# EAGLE design FC (EAGLE 9.6.2)
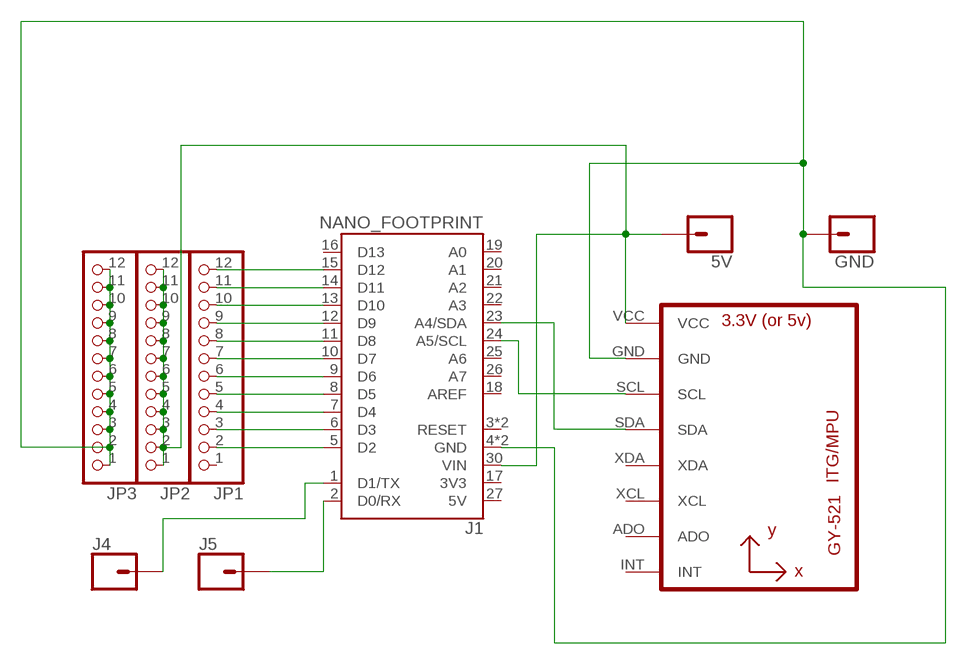
[diagram p0: schematic, sheet 1]

## Parts
5V  CONN_01PTH_NO_SILK_SMALL  [1X01_SMALL]
GND  CONN_01PTH_NO_SILK_SMALL  [1X01_SMALL]
J1  NANO_FOOTPRINT  [NANO]
J4  CONN_01  [1X01]
J5  CONN_01  [1X01]
JP1  PINHD-1X12-CB  [1X12-CB]
JP2  PINHD-1X12-CB  [1X12-CB]
JP3  PINHD-1X12-CB  [1X12-CB]
U1  GY-521MPU6050  [GY-521]

## Nets
N$1: J1.24(A5/SCL) U1.SCL
N$2: J1.23(A4/SDA) U1.SDA
N$5: J1.6(D3) JP1.3
N$6: J1.7(D4) JP1.4
N$7: J1.9(D6) JP1.6
N$8: J1.10(D7) JP1.7
N$10: 5V.P$1 GND.P$1 J1.4(GND) J1.5(D2) J1.8(D5) J1.29(GND) J1.30(VIN) JP1.2 JP1.5 JP2.1 JP2.2 JP2.3 JP2.4 JP2.5 JP2.6 JP2.7 JP2.8 JP2.9 JP2.10 JP2.11 JP2.12 JP3.1 JP3.2 JP3.3 JP3.4 JP3.5 JP3.6 JP3.7 JP3.8 JP3.9 JP3.10 JP3.11 JP3.12 U1.GND U1.VCC
N$11: J1.11(D8) JP1.8
N$12: J1.12(D9) JP1.9
N$13: J1.13(D10) JP1.10
N$14: J1.14(D11) JP1.11
N$15: J1.15(D12) JP1.12
N$16: J1.1(D1/TX) J4.1
N$17: J1.2(D0/RX) J5.1
Unconnected: J1.3(RESET) J1.16(D13) J1.17(3V3) J1.18(AREF) J1.19(A0) J1.20(A1) J1.21(A2) J1.22(A3) J1.25(A6) J1.26(A7) J1.27(5V) J1.28(RESET) JP1.1 U1.ADO U1.INT U1.XCL U1.XDA

## Library data of the parts
5V = SparkFun-Connectors:CONN_01: Single connection point. Often used as Generic Header-pin footprint for 0.1 inch spaced/style header connections On any of the 0.1 inch spaced packages, you can populate with these: Break Away Headers - Straight <https://www.sparkfun.com/products/116> (PRT-00116) Break Away Male Headers - Right Angle <https://www.sparkfun.com/products/553> (PRT-00553) Female Headers <https://www.sparkfun.com/products/115> (PRT-00115) Break Away Headers - Machine Pin <https://www.sparkfun.com/products/117> (PRT-00117) Break Away Female Headers - Swiss Machine Pin <https://www.sparkfun.com/products/743> (PRT-00743) This device is also useful as a general connection point to wire up your design to another part of your project. Our various solder wires solder well into these plated through hole pads. Hook-Up Wire - Assortment (Stranded, 22 AWG) <https://www.sparkfun.com/products/11375> (PRT-11375) Hook-Up Wire - Assortment (Solid Core, 22 AWG) <https://www.sparkfun.com/products/11367> (PRT-11367) View the entire wire category on our website here <https://www.sparkfun.com/categories/141> Special notes: SMTSO-256-ET is a "flush mount" nut for a 4-40 screw. We mostly use this on specialty testbeds; it is a nice way to connect hardware to your PCB at an adjustable hieght. Also note, the SNAP packages are for using a snappable style connector. We sell a baggie of snaps and they are also used on two LilyPad designs: Snap Assortment - 30 pack (male and female) <https://www.sparkfun.com/products/11347> (DEV-11347) LilyPad Arduino SimpleSnap <https://www.sparkfun.com/products/10941> (DEV-10941) LilyPad SimpleSnap Protoboard <https://www.sparkfun.com/products/10940> (DEV-10940); SPICEPREFIX: X
GND J4 J5 = SparkFun-Connectors:CONN_01: Single connection point. Often used as Generic Header-pin footprint for 0.1 inch spaced/style header connections On any of the 0.1 inch spaced packages, you can populate with these: Break Away Headers - Straight <https://www.sparkfun.com/products/116> (PRT-00116) Break Away Male Headers - Right Angle <https://www.sparkfun.com/products/553> (PRT-00553) Female Headers <https://www.sparkfun.com/products/115> (PRT-00115) Break Away Headers - Machine Pin <https://www.sparkfun.com/products/117> (PRT-00117) Break Away Female Headers - Swiss Machine Pin <https://www.sparkfun.com/products/743> (PRT-00743) This device is also useful as a general connection point to wire up your design to another part of your project. Our various solder wires solder well into these plated through hole pads. Hook-Up Wire - Assortment (Stranded, 22 AWG) <https://www.sparkfun.com/products/11375> (PRT-11375) Hook-Up Wire - Assortment (Solid Core, 22 AWG) <https://www.sparkfun.com/products/11367> (PRT-11367) View the entire wire category on our website here <https://www.sparkfun.com/categories/141> Special notes: SMTSO-256-ET is a "flush mount" nut for a 4-40 screw. We mostly use this on specialty testbeds; it is a nice way to connect hardware to your PCB at an adjustable hieght. Also note, the SNAP packages are for using a snappable style connector. We sell a baggie of snaps and they are also used on two LilyPad designs: Snap Assortment - 30 pack (male and female) <https://www.sparkfun.com/products/11347> (DEV-11347) LilyPad Arduino SimpleSnap <https://www.sparkfun.com/products/10941> (DEV-10941) LilyPad SimpleSnap Protoboard <https://www.sparkfun.com/products/10940> (DEV-10940)
J1 = SparkFun-Boards:NANO_FOOTPRINT: Generic Nano Footprint
JP1-JP3 = adafruit:PINHD-1X12: PIN HEADER
U1 = gy-521:GY-521

## Board
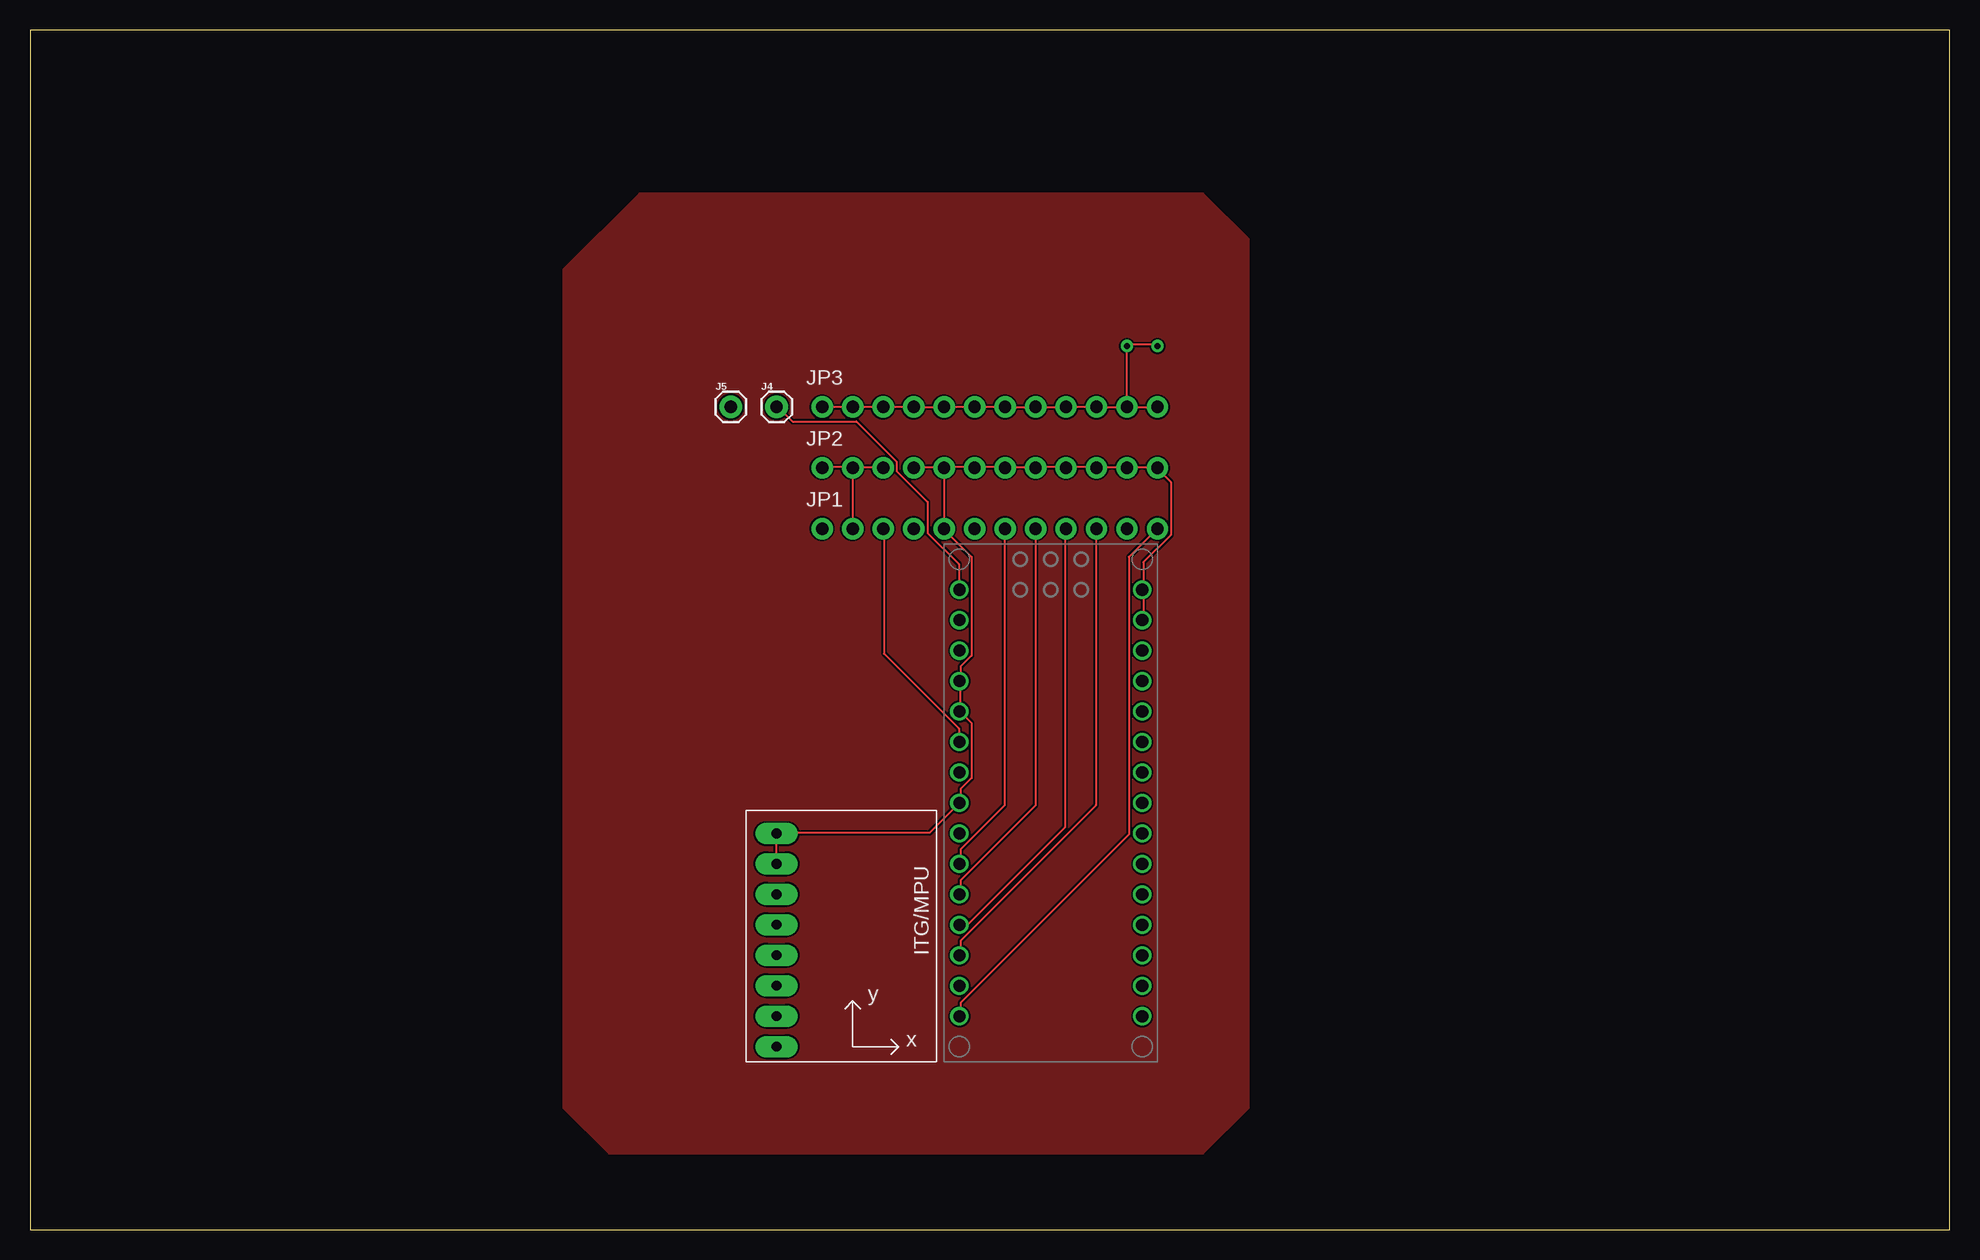
[diagram p1: board, top side]
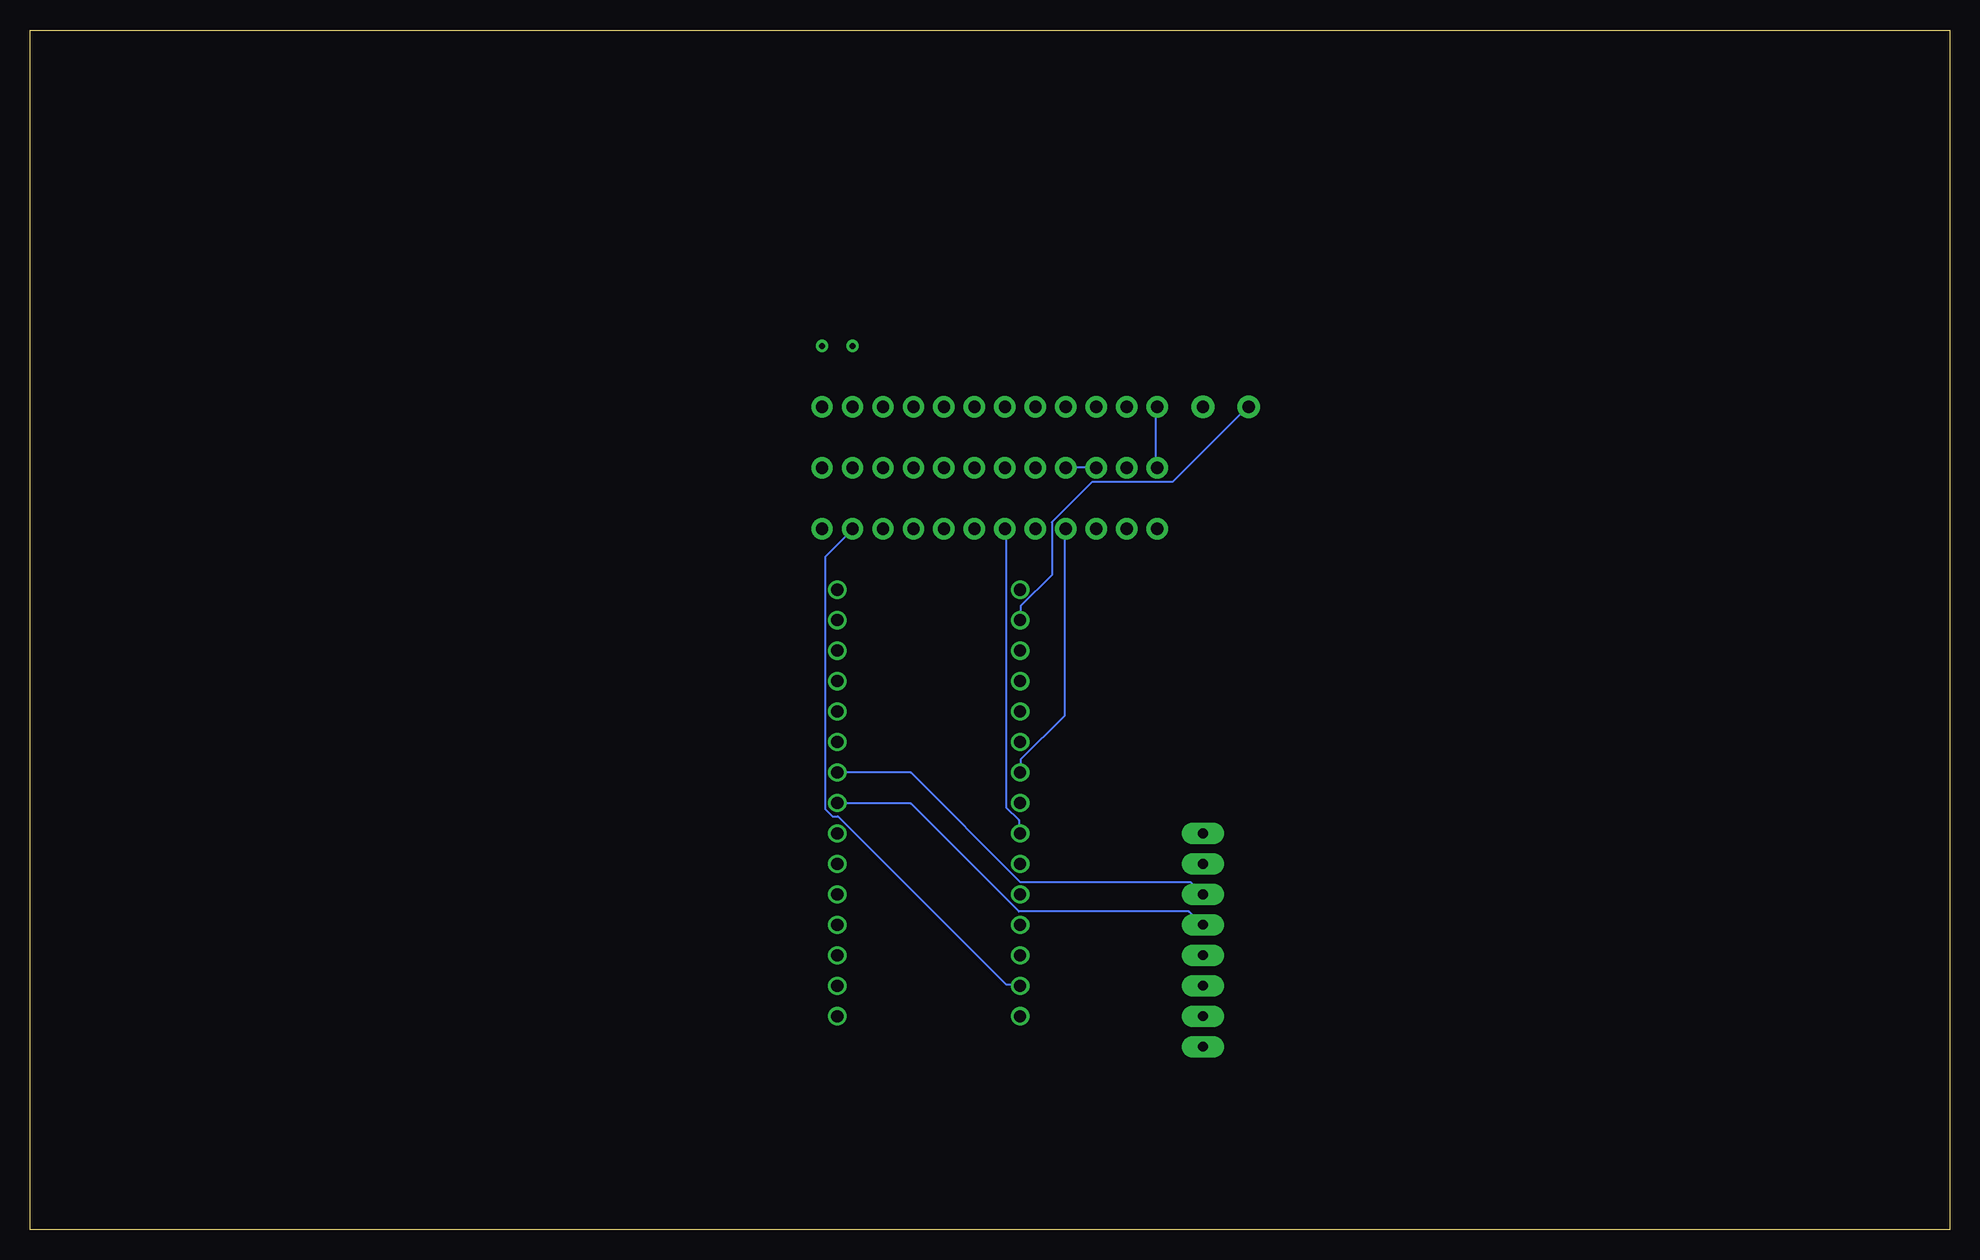
[diagram p2: board, bottom side, seen from below]

Size 160 x 100 mm. Coordinates in mm from the lower left corner, seen from the top.
Outline: 0,0 160,0 160,100 0,100 0,0
Copper layers (1*16): Top 0.035mm / dielectric 1.5mm / Bottom 0.035mm
Design rules "default": minimum track width 6mil, minimum drill 0.35mm, track to track 6mil, track to pad 6mil, pad to pad 6mil, via to via 6mil, smd to smd 6mil, copper to edge 40mil, drill to drill 6mil, minimum pad ring 10mil, minimum via ring 8mil, stop-mask expansion 4mil, vias tented up to drill 0mil, thermal gap 10mil

### Footprints (pad centres in the part's own frame; a part is rotated, then mirrored left to right if it is on the bottom)
1X01_SMALL = drill 0.508: P$1 0,0
NANO = drill 1.016: 1 -7.62,17.78; 2 -7.62,15.24; 3 -7.62,12.7; 4 -7.62,10.16; 5 -7.62,7.62; 6 -7.62,5.08; 7 -7.62,2.54; 8 -7.62,0; 9 -7.62,-2.54; 10 -7.62,-5.08; 11 -7.62,-7.62; 12 -7.62,-10.16; 13 -7.62,-12.7; 14 -7.62,-15.24; 15 -7.62,-17.78; 16 7.62,-17.78; 17 7.62,-15.24; 18 7.62,-12.7; 19 7.62,-10.16; 20 7.62,-7.62; 21 7.62,-5.08; 22 7.62,-2.54; 23 7.62,0; 24 7.62,2.54; 25 7.62,5.08; 26 7.62,7.62; 27 7.62,10.16; 28 7.62,12.7; 29 7.62,15.24; 30 7.62,17.78
1X01 = drill 1.016 pad 1.88: 1 0,0
1X12-CB = drill 1.016 pad 1.778: 1 -13.97,0; 2 -11.43,0; 3 -8.89,0; 4 -6.35,0; 5 -3.81,0; 6 -1.27,0; 7 1.27,0; 8 3.81,0; 9 6.35,0; 10 8.89,0; 11 11.43,0; 12 13.97,0
GY-521 = drill 0.8 pad 1.778 long: ADO -8.89,-6.35; GND -8.89,6.35; INT -8.89,-8.89; SCL -8.89,3.81; SDA -8.89,1.27; VCC -8.89,8.89; XCL -8.89,-3.81; XDA -8.89,-1.27

### Placement (x,y rotation side)
5V  93.98,73.66 0 top
GND  91.44,73.66 0 top
J1  85.09,35.56 0 top
J4  62.23,68.58 0 top
J5  58.42,68.58 0 top
JP1  80.01,58.42 0 top
JP2  80.01,63.5 0 top
JP3  80.01,68.58 0 top
U1  71.12,24.13 0 top

### Tracks (layer width: path | path; a pad name or v marks a point on that pad's centre or on a via)
N$1
  Bottom 0.152: J1.24 86.56,38.1 77.42,28.96 63.25,28.96 U1.SCL
N$2
  Bottom 0.152: J1.23 92.66,35.51 86.56,35.51 77.57,26.52 63.4,26.52 62.33,25.45 U1.SDA
N$3
  pour Top: 44.45,80.01 44.45,10.16 48.26,6.35 97.79,6.35 101.6,10.16 101.6,82.55 97.79,86.36 50.8,86.36
N$5
  Top 0.152: J1.6 77.42,40.69 77.42,41.76 71.17,48.01 71.17,58.37 JP1.3
N$6
  Bottom 0.152: J1.7 77.42,38.1 77.42,39.17 73.76,42.82 73.76,58.37 JP1.4
N$7
  Bottom 0.152: J1.9 77.57,33.07 77.57,34.14 78.64,35.2 78.64,58.37 JP1.6
N$8
  Top 0.152: J1.10 77.57,30.48 77.57,31.7 81.23,35.36 81.23,58.37 JP1.7
N$10
  Top 0.152: JP3.1 JP3.2 JP3.3 JP3.4 JP3.5 JP3.6 JP3.7 JP3.8 JP3.9 JP3.10 JP3.11 | 5V.P$1 93.88,73.76 91.44,73.76 GND.P$1 JP3.11 | JP3.11 JP3.12 | U1.GND 62.18,30.48 62.18,32.92 U1.VCC 62.33,33.07 74.98,33.07 J1.8 77.57,35.66 77.57,36.73 78.49,37.64 78.49,42.22 77.57,43.13 J1.5 77.57,43.28 77.57,45.72 | JP1.2 JP2.2 68.58,63.55 | 68.58,63.55 66.14,63.55 JP2.1 | 68.58,63.55 71.02,63.55 JP2.3 | 76.2,63.55 73.76,63.55 JP2.4 | 83.82,63.55 81.38,63.55 JP2.7 81.23,63.55 78.79,63.55 JP2.6 78.64,63.55 76.2,63.55 | 92.81,53.34 92.81,50.9 J1.29 | 91.44,63.55 89,63.55 JP2.10 88.85,63.55 86.41,63.55 JP2.9 86.26,63.55 83.82,63.55 | 91.44,63.55 93.88,63.55 JP2.12 94.03,63.4 95.1,62.33 95.1,57.91 92.81,55.63 92.81,53.34 | 91.44,63.55 JP2.11 | 92.81,53.34 J1.30 | 83.82,63.55 JP2.8 | 76.2,63.55 JP2.5 JP1.5 76.2,58.37 78.49,56.08 78.49,47.85 77.57,46.94 77.57,45.72 | 77.57,45.72 J1.4
  Bottom 0.152: JP2.3 71.17,63.55 73.61,63.55 JP2.4 | JP3.1 66.14,68.58 66.14,63.55 JP2.1
N$11
  Top 0.152: JP1.8 83.82,35.36 77.57,29.11 77.57,28.04 J1.11
N$12
  Top 0.152: J1.12 77.57,25.45 78.18,25.45 86.26,33.53 86.26,58.37 JP1.9
N$13
  Top 0.152: J1.13 77.57,22.86 77.57,24.08 88.85,35.36 88.85,58.37 JP1.10
N$14
  Bottom 0.152: J1.14 77.57,20.42 78.64,20.42 92.66,34.44 93.12,34.44 93.73,35.05 93.73,56.08 91.44,58.37 JP1.11
N$15
  Top 0.152: J1.15 77.57,17.83 77.57,18.9 91.59,32.92 91.59,56.08 93.88,58.37 JP1.12
N$16
  Top 0.152: J1.1 77.42,53.34 77.42,55.47 74.83,58.06 74.83,60.66 72.24,63.25 72.24,64.01 68.89,67.36 63.55,67.36 62.33,68.58 J4.1
N$17
  Bottom 0.152: J1.2 77.42,50.9 77.42,51.97 74.83,54.56 74.83,58.98 71.48,62.33 64.77,62.33 58.52,68.58 J5.1